# EAGLE schematic CAMERA_SHIELD (EAGLE 9.5.2)

## Sheet 1 of 2
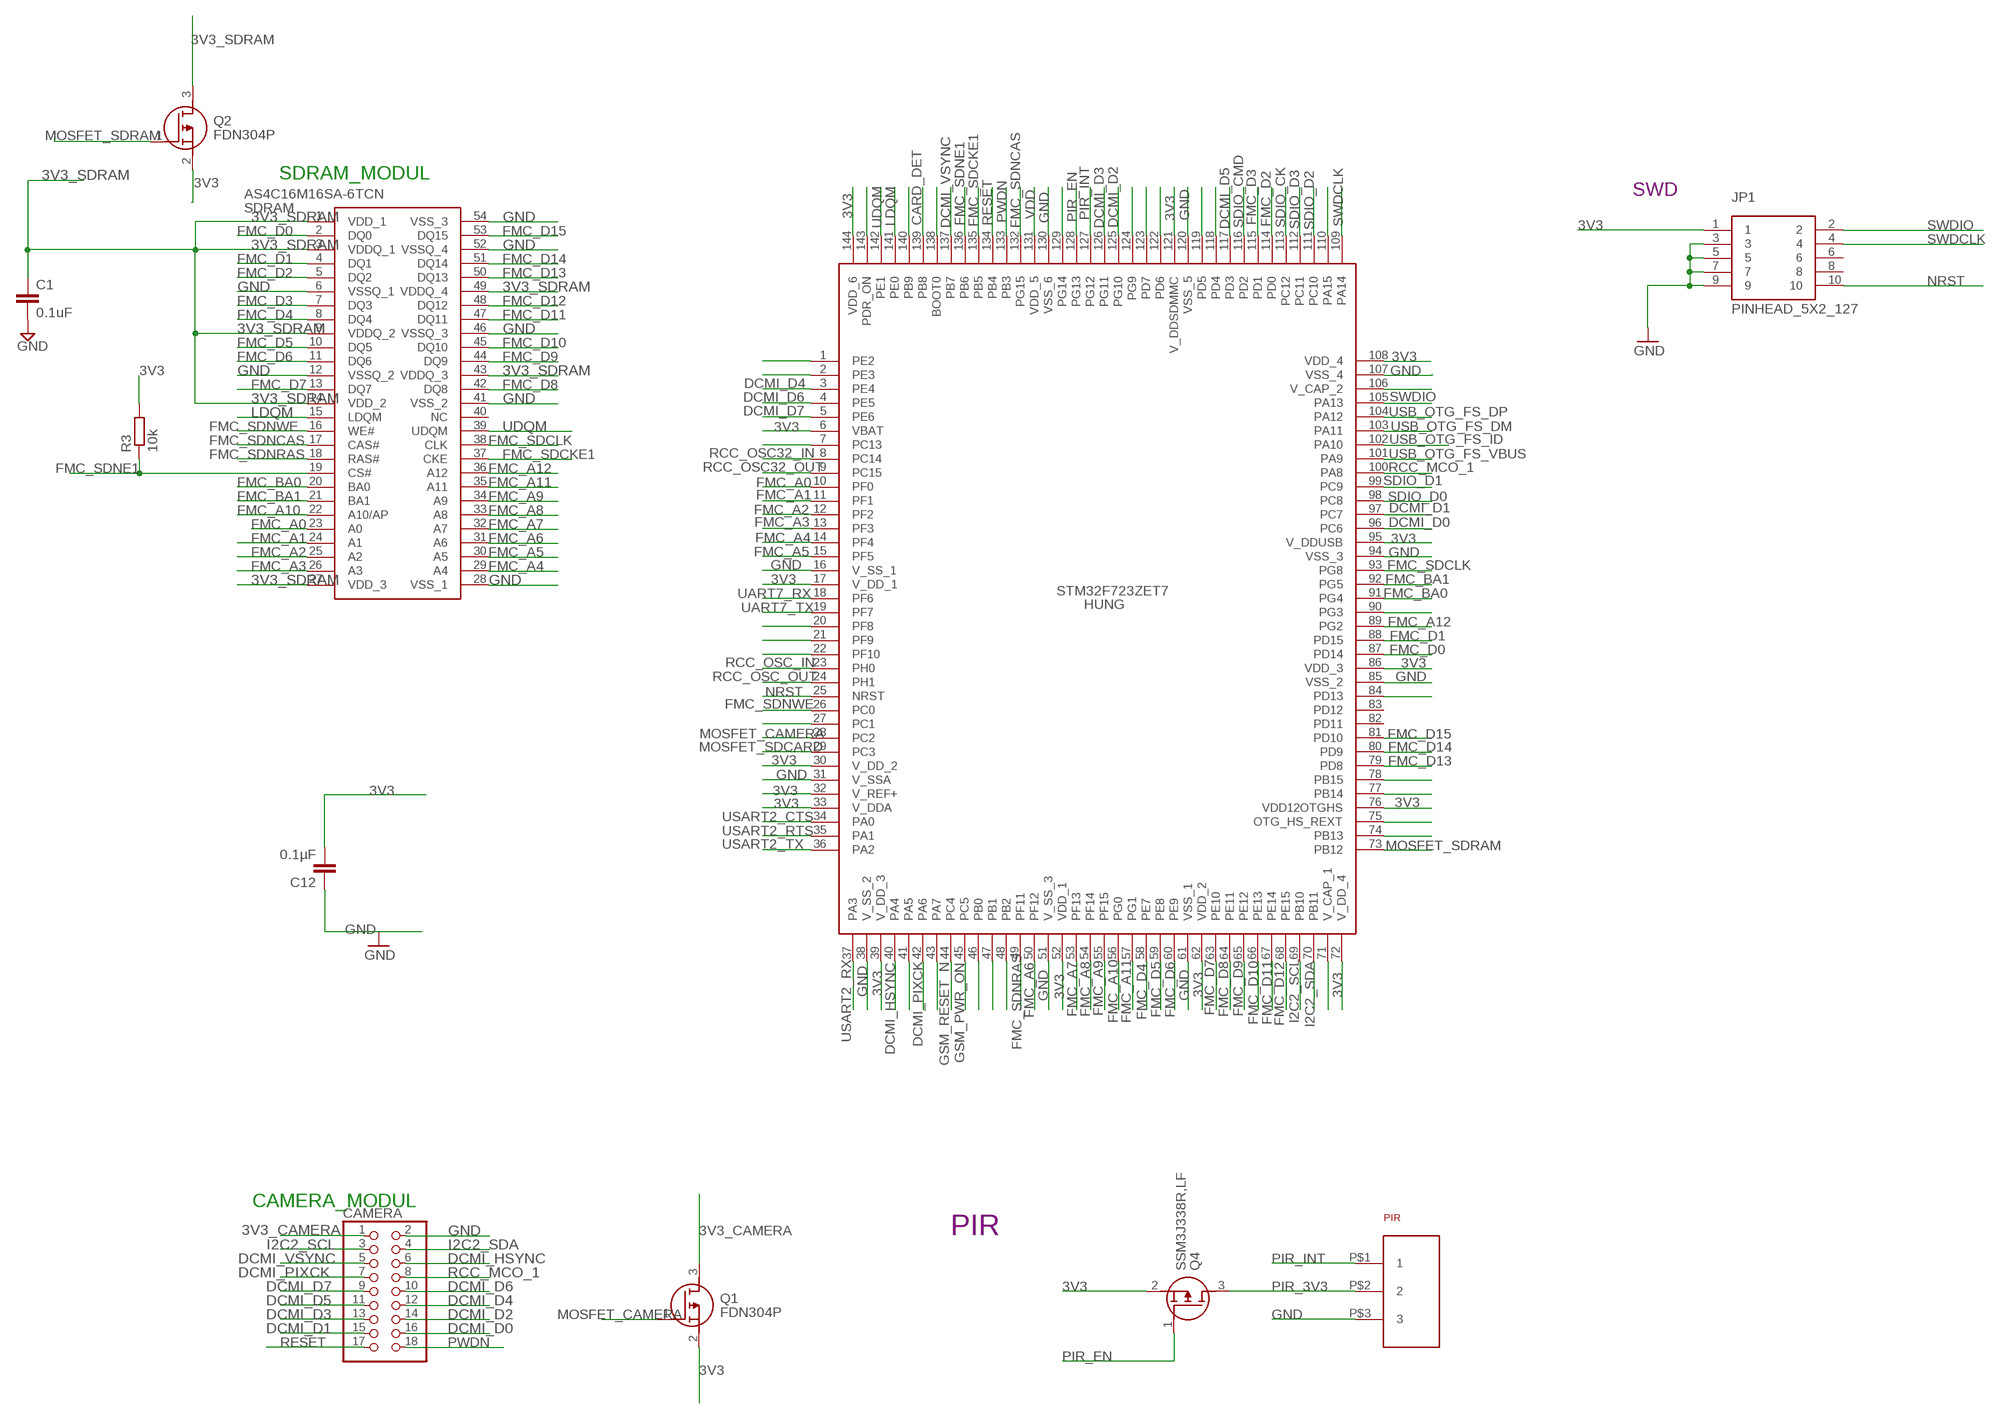
[diagram p0: schematic, sheet 1]

### Parts
C1  0.1uF  C-EUC0402K  [C0402K]
C12  0.1µF  C-EUC0402K  [C0402K]
CAMERA  0  PINHD-2X9  [2X09]
HUNG  STM32F723ZET7  [QFP50P2200X2200X160-144N]
JP1  PINHEAD_5X2_127  [PINHEAD_2X5_127]
PIR  SENBA_PIR_3PIN  [SENBA_PIR]
Q1  FDN304P  [SOT95P237X112-3N]
Q2  FDN304P  [SOT95P237X112-3N]
Q4  SSM3J338R,LF  [SSM3J332RLFT]
R3  10k  R_0402WEB_0402  [C0402K]
SDRAM  AS4C16M16SA-6TCN  [SOP80P1176X120-54N]

### Nets
3V3: C12.2 HUNG.6(VBAT) HUNG.17(V_DD_1) HUNG.30(V_DD_2) HUNG.32(V_REF+) HUNG.33(V_DDA) HUNG.39(V_DD_3) HUNG.52(VDD_1) HUNG.62(VDD_2) HUNG.72(V_DD_4) HUNG.76(VDD12OTGHS) HUNG.86(VDD_3) HUNG.95(V_DDUSB) HUNG.108(VDD_4) HUNG.121(V_DDSDMMC) HUNG.144(VDD_6) JP1.1 Q1.2(S) Q2.2(S) Q4.2(S) R3.2 ; also sheet 2
3V3_CAMERA: CAMERA.1 Q1.3(D)
3V3_SDRAM: C1.1 Q2.3(D) SDRAM.1(VDD_1) SDRAM.3(VDDQ_1) SDRAM.9(VDDQ_2) SDRAM.14(VDD_2) SDRAM.27(VDD_3) SDRAM.43(VDDQ_3) SDRAM.49(VDDQ_4)
CARD_DET: HUNG.139(PB8) ; also sheet 2
DCMI_D0: CAMERA.16 HUNG.96(PC6)
DCMI_D1: CAMERA.15 HUNG.97(PC7)
DCMI_D2: CAMERA.14 HUNG.125(PG10)
DCMI_D3: CAMERA.13 HUNG.126(PG11)
DCMI_D4: CAMERA.12 HUNG.3(PE4)
DCMI_D5: CAMERA.11 HUNG.117(PD3)
DCMI_D6: CAMERA.10 HUNG.4(PE5)
DCMI_D7: CAMERA.9 HUNG.5(PE6)
DCMI_HSYNC: CAMERA.6 HUNG.40(PA4)
DCMI_PIXCK: CAMERA.7 HUNG.42(PA6)
DCMI_VSYNC: CAMERA.5 HUNG.137(PB7)
FMC_A0: HUNG.10(PF0) SDRAM.23(A0)
FMC_A1: HUNG.11(PF1) SDRAM.24(A1)
FMC_A2: HUNG.12(PF2) SDRAM.25(A2)
FMC_A3: HUNG.13(PF3) SDRAM.26(A3)
FMC_A4: HUNG.14(PF4) SDRAM.29(A4)
FMC_A5: HUNG.15(PF5) SDRAM.30(A5)
FMC_A6: HUNG.50(PF12) SDRAM.31(A6)
FMC_A7: HUNG.53(PF13) SDRAM.32(A7)
FMC_A8: HUNG.54(PF14) SDRAM.33(A8)
FMC_A9: HUNG.55(PF15) SDRAM.34(A9)
FMC_A10: HUNG.56(PG0) SDRAM.22(A10/AP)
FMC_A11: HUNG.57(PG1) SDRAM.35(A11)
FMC_A12: HUNG.89(PG2) SDRAM.36(A12)
FMC_BA0: HUNG.91(PG4) SDRAM.20(BA0)
FMC_BA1: HUNG.92(PG5) SDRAM.21(BA1)
FMC_D0: HUNG.87(PD14) SDRAM.2(DQ0)
FMC_D1: HUNG.88(PD15) SDRAM.4(DQ1)
FMC_D2: HUNG.114(PD0) SDRAM.5(DQ2)
FMC_D3: HUNG.115(PD1) SDRAM.7(DQ3)
FMC_D4: HUNG.58(PE7) SDRAM.8(DQ4)
FMC_D5: HUNG.59(PE8) SDRAM.10(DQ5)
FMC_D6: HUNG.60(PE9) SDRAM.11(DQ6)
FMC_D7: HUNG.63(PE10) SDRAM.13(DQ7)
FMC_D8: HUNG.64(PE11) SDRAM.42(DQ8)
FMC_D9: HUNG.65(PE12) SDRAM.44(DQ9)
FMC_D10: HUNG.66(PE13) SDRAM.45(DQ10)
FMC_D11: HUNG.67(PE14) SDRAM.47(DQ11)
FMC_D12: HUNG.68(PE15) SDRAM.48(DQ12)
FMC_D13: HUNG.79(PD8) SDRAM.50(DQ13)
FMC_D14: HUNG.80(PD9) SDRAM.51(DQ14)
FMC_D15: HUNG.81(PD10) SDRAM.53(DQ15)
FMC_SDCKE1: HUNG.135(PB5) SDRAM.37(CKE)
FMC_SDCLK: HUNG.93(PG8) SDRAM.38(CLK)
FMC_SDNCAS: HUNG.132(PG15) SDRAM.17(CAS#)
FMC_SDNE1: HUNG.136(PB6) R3.1 SDRAM.19(CS#)
FMC_SDNRAS: HUNG.49(PF11) SDRAM.18(RAS#)
FMC_SDNWE: HUNG.26(PC0) SDRAM.16(WE#)
GND: C1.2 C12.1 CAMERA.2 HUNG.16(V_SS_1) HUNG.31(V_SSA) HUNG.38(V_SS_2) HUNG.51(V_SS_3) HUNG.61(VSS_1) HUNG.85(VSS_2) HUNG.94(VSS_3) HUNG.107(VSS_4) HUNG.120(VSS_5) HUNG.130(VSS_6) JP1.3 JP1.5 JP1.7 JP1.9 PIR.P$3 SDRAM.6(VSSQ_1) SDRAM.12(VSSQ_2) SDRAM.28(VSS_1) SDRAM.41(VSS_2) SDRAM.46(VSSQ_3) SDRAM.52(VSSQ_4) SDRAM.54(VSS_3) ; also sheet 2
GSM_PWR_ON: HUNG.45(PC5) ; also sheet 2
GSM_RESET_N: HUNG.44(PC4) ; also sheet 2
I2C2_SCL: CAMERA.3 HUNG.69(PB10) ; also sheet 2
I2C2_SDA: CAMERA.4 HUNG.70(PB11) ; also sheet 2
LDQM: HUNG.141(PE0) SDRAM.15(LDQM)
MOSFET_CAMERA: HUNG.28(PC2) Q1.1(G)
MOSFET_SDCARD: HUNG.29(PC3) ; also sheet 2
MOSFET_SDRAM: HUNG.73(PB12) Q2.1(G)
N$1: HUNG.1(PE2)
N$2: HUNG.2(PE3)
N$7: HUNG.7(PC13)
N$20: HUNG.20(PF8)
N$21: HUNG.21(PF9)
N$22: HUNG.22(PF10)
N$27: HUNG.27(PC1)
N$41: HUNG.41(PA5)
N$43: HUNG.43(PA7)
N$46: HUNG.46(PB0)
N$47: HUNG.47(PB1)
N$48: HUNG.48(PB2)
N$71: HUNG.71(V_CAP_1)
N$75: HUNG.106(V_CAP_2)
N$91: HUNG.90(PG3)
N$97: HUNG.84(PD13)
N$103: HUNG.78(PB15)
N$104: HUNG.77(PB14)
N$106: HUNG.75(OTG_HS_REXT)
N$107: HUNG.74(PB13)
N$110: HUNG.143(PDR_ON)
N$113: HUNG.140(PB9)
N$115: HUNG.138(BOOT0)
N$124: HUNG.129(PG14)
N$129: HUNG.124(PG9)
N$130: HUNG.123(PD7)
N$131: HUNG.122(PD6)
N$134: HUNG.119(PD5)
N$135: HUNG.118(PD4)
N$143: HUNG.110(PA15)
NRST: HUNG.25(NRST) JP1.10
PIR_3V3: PIR.P$2 Q4.3(D)
PIR_EN: HUNG.128(PG13) Q4.1(G)
PIR_INT: HUNG.127(PG12) PIR.P$1
PWDN: CAMERA.18 HUNG.133(PB3)
RCC_MCO_1: CAMERA.8 HUNG.100(PA8)
RCC_OSC32_IN: HUNG.8(PC14) ; also sheet 2
RCC_OSC32_OUT: HUNG.9(PC15) ; also sheet 2
RCC_OSC_IN: HUNG.23(PH0) ; also sheet 2
RCC_OSC_OUT: HUNG.24(PH1) ; also sheet 2
RESET: CAMERA.17 HUNG.134(PB4)
SDIO_CK: HUNG.113(PC12) ; also sheet 2
SDIO_CMD: HUNG.116(PD2) ; also sheet 2
SDIO_D0: HUNG.98(PC8) ; also sheet 2
SDIO_D1: HUNG.99(PC9) ; also sheet 2
SDIO_D2: HUNG.111(PC10) ; also sheet 2
SDIO_D3: HUNG.112(PC11) ; also sheet 2
SWDCLK: HUNG.109(PA14) JP1.4
SWDIO: HUNG.105(PA13) JP1.2
UART7_RX: HUNG.18(PF6) ; also sheet 2
UART7_TX: HUNG.19(PF7) ; also sheet 2
UDQM: HUNG.142(PE1) SDRAM.39(UDQM)
USART2_CTS: HUNG.34(PA0) ; also sheet 2
USART2_RTS: HUNG.35(PA1) ; also sheet 2
USART2_RX: HUNG.37(PA3) ; also sheet 2
USART2_TX: HUNG.36(PA2) ; also sheet 2
USB_OTG_FS_DM: HUNG.103(PA11) ; also sheet 2
USB_OTG_FS_DP: HUNG.104(PA12) ; also sheet 2
USB_OTG_FS_ID: HUNG.102(PA10) ; also sheet 2
USB_OTG_FS_VBUS: HUNG.101(PA9) ; also sheet 2
VDD: HUNG.131(VDD_5)
Unconnected: HUNG.82(PD11) HUNG.83(PD12) JP1.6 JP1.8 SDRAM.40(NC)

### Notes on the sheet
- SDRAM_MODUL
- SWD
- CAMERA_MODUL
- PIR

## Sheet 2 of 2
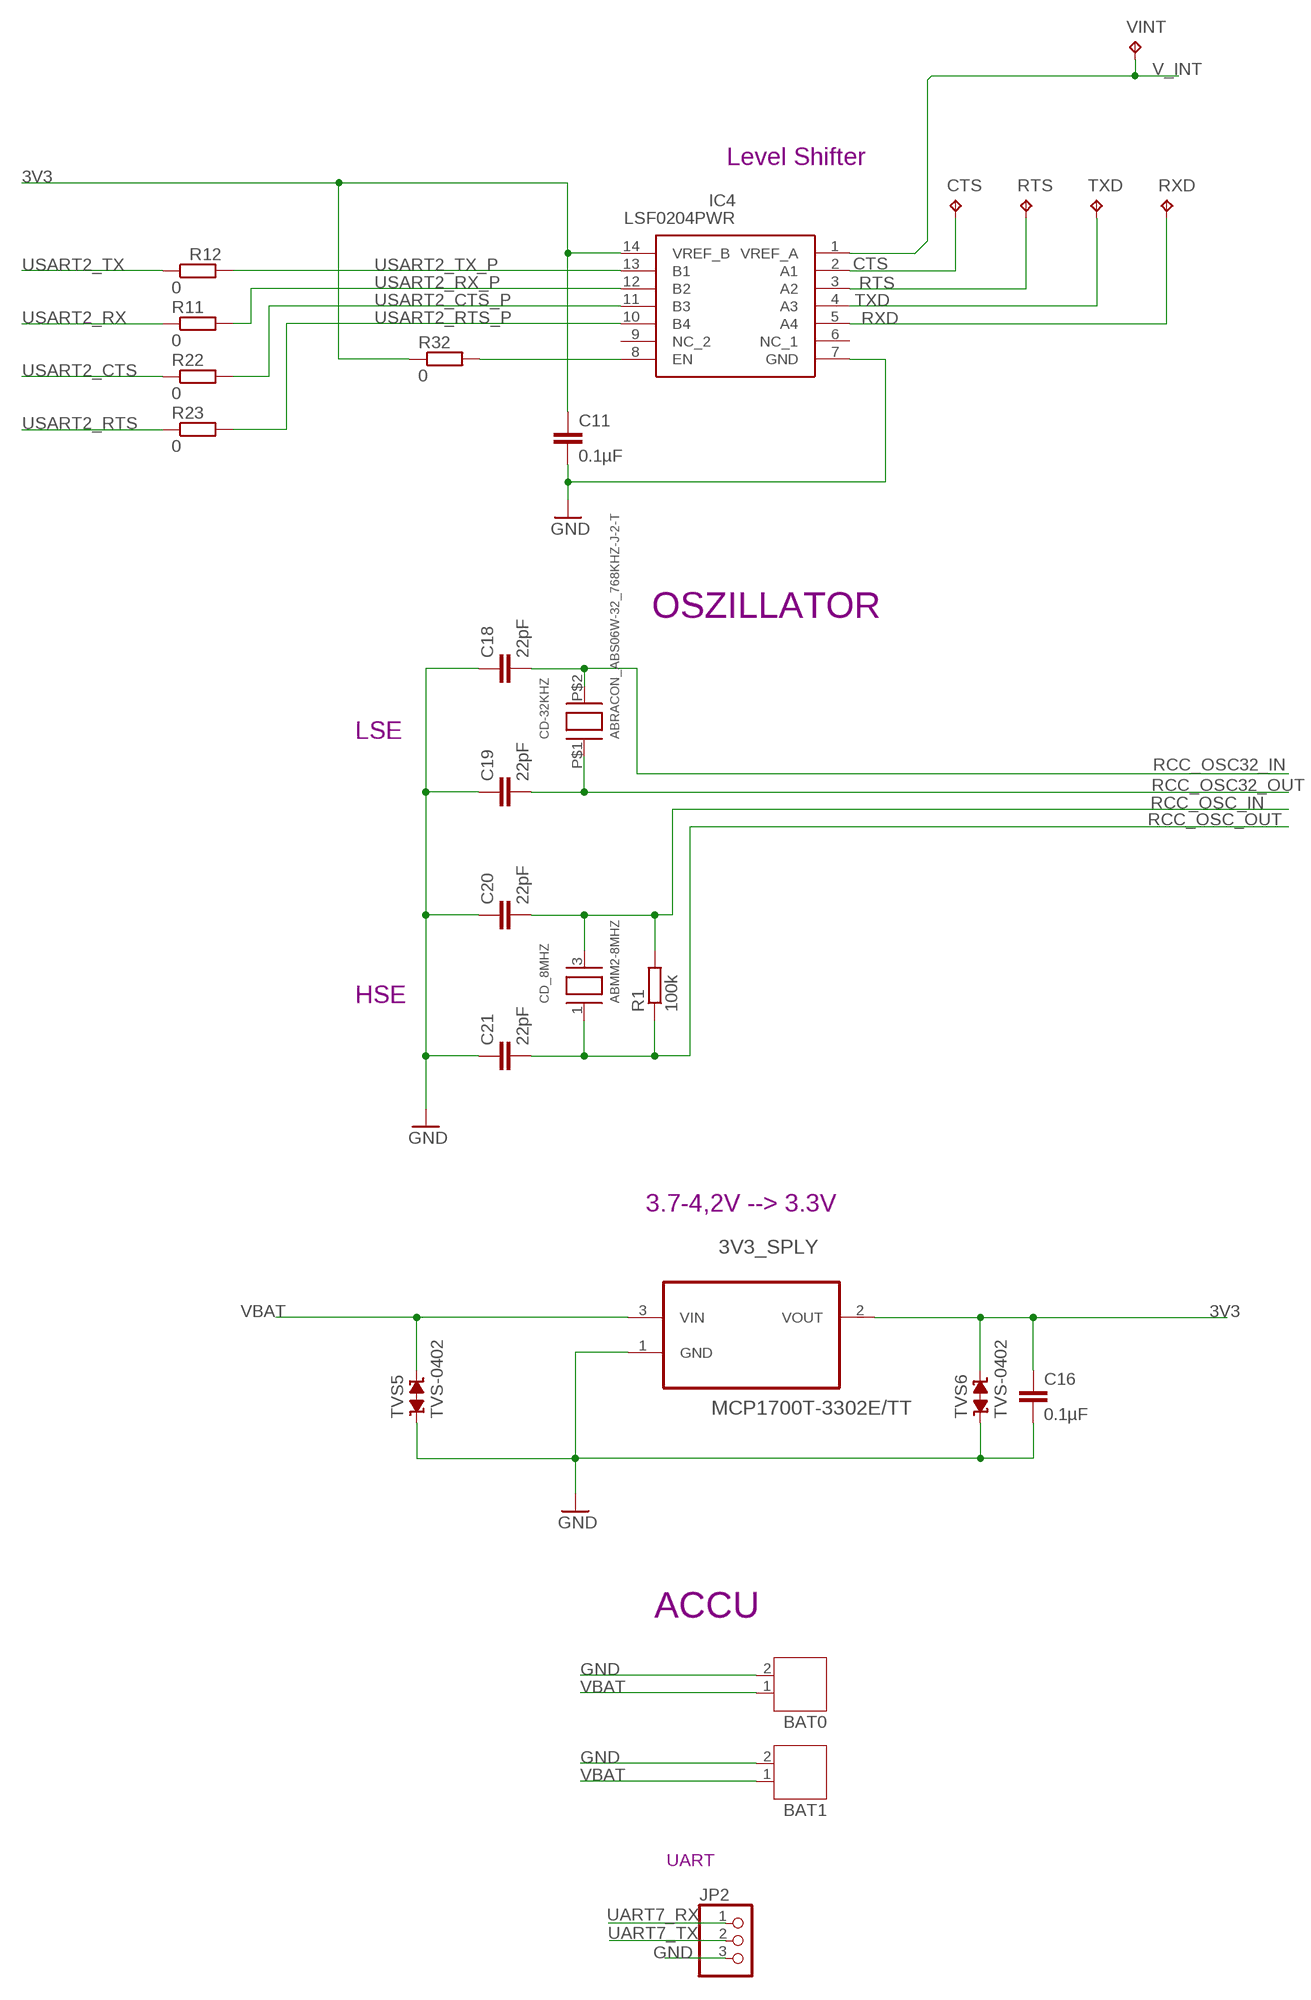
[diagram p1: schematic, sheet 2, part 1 of 2]
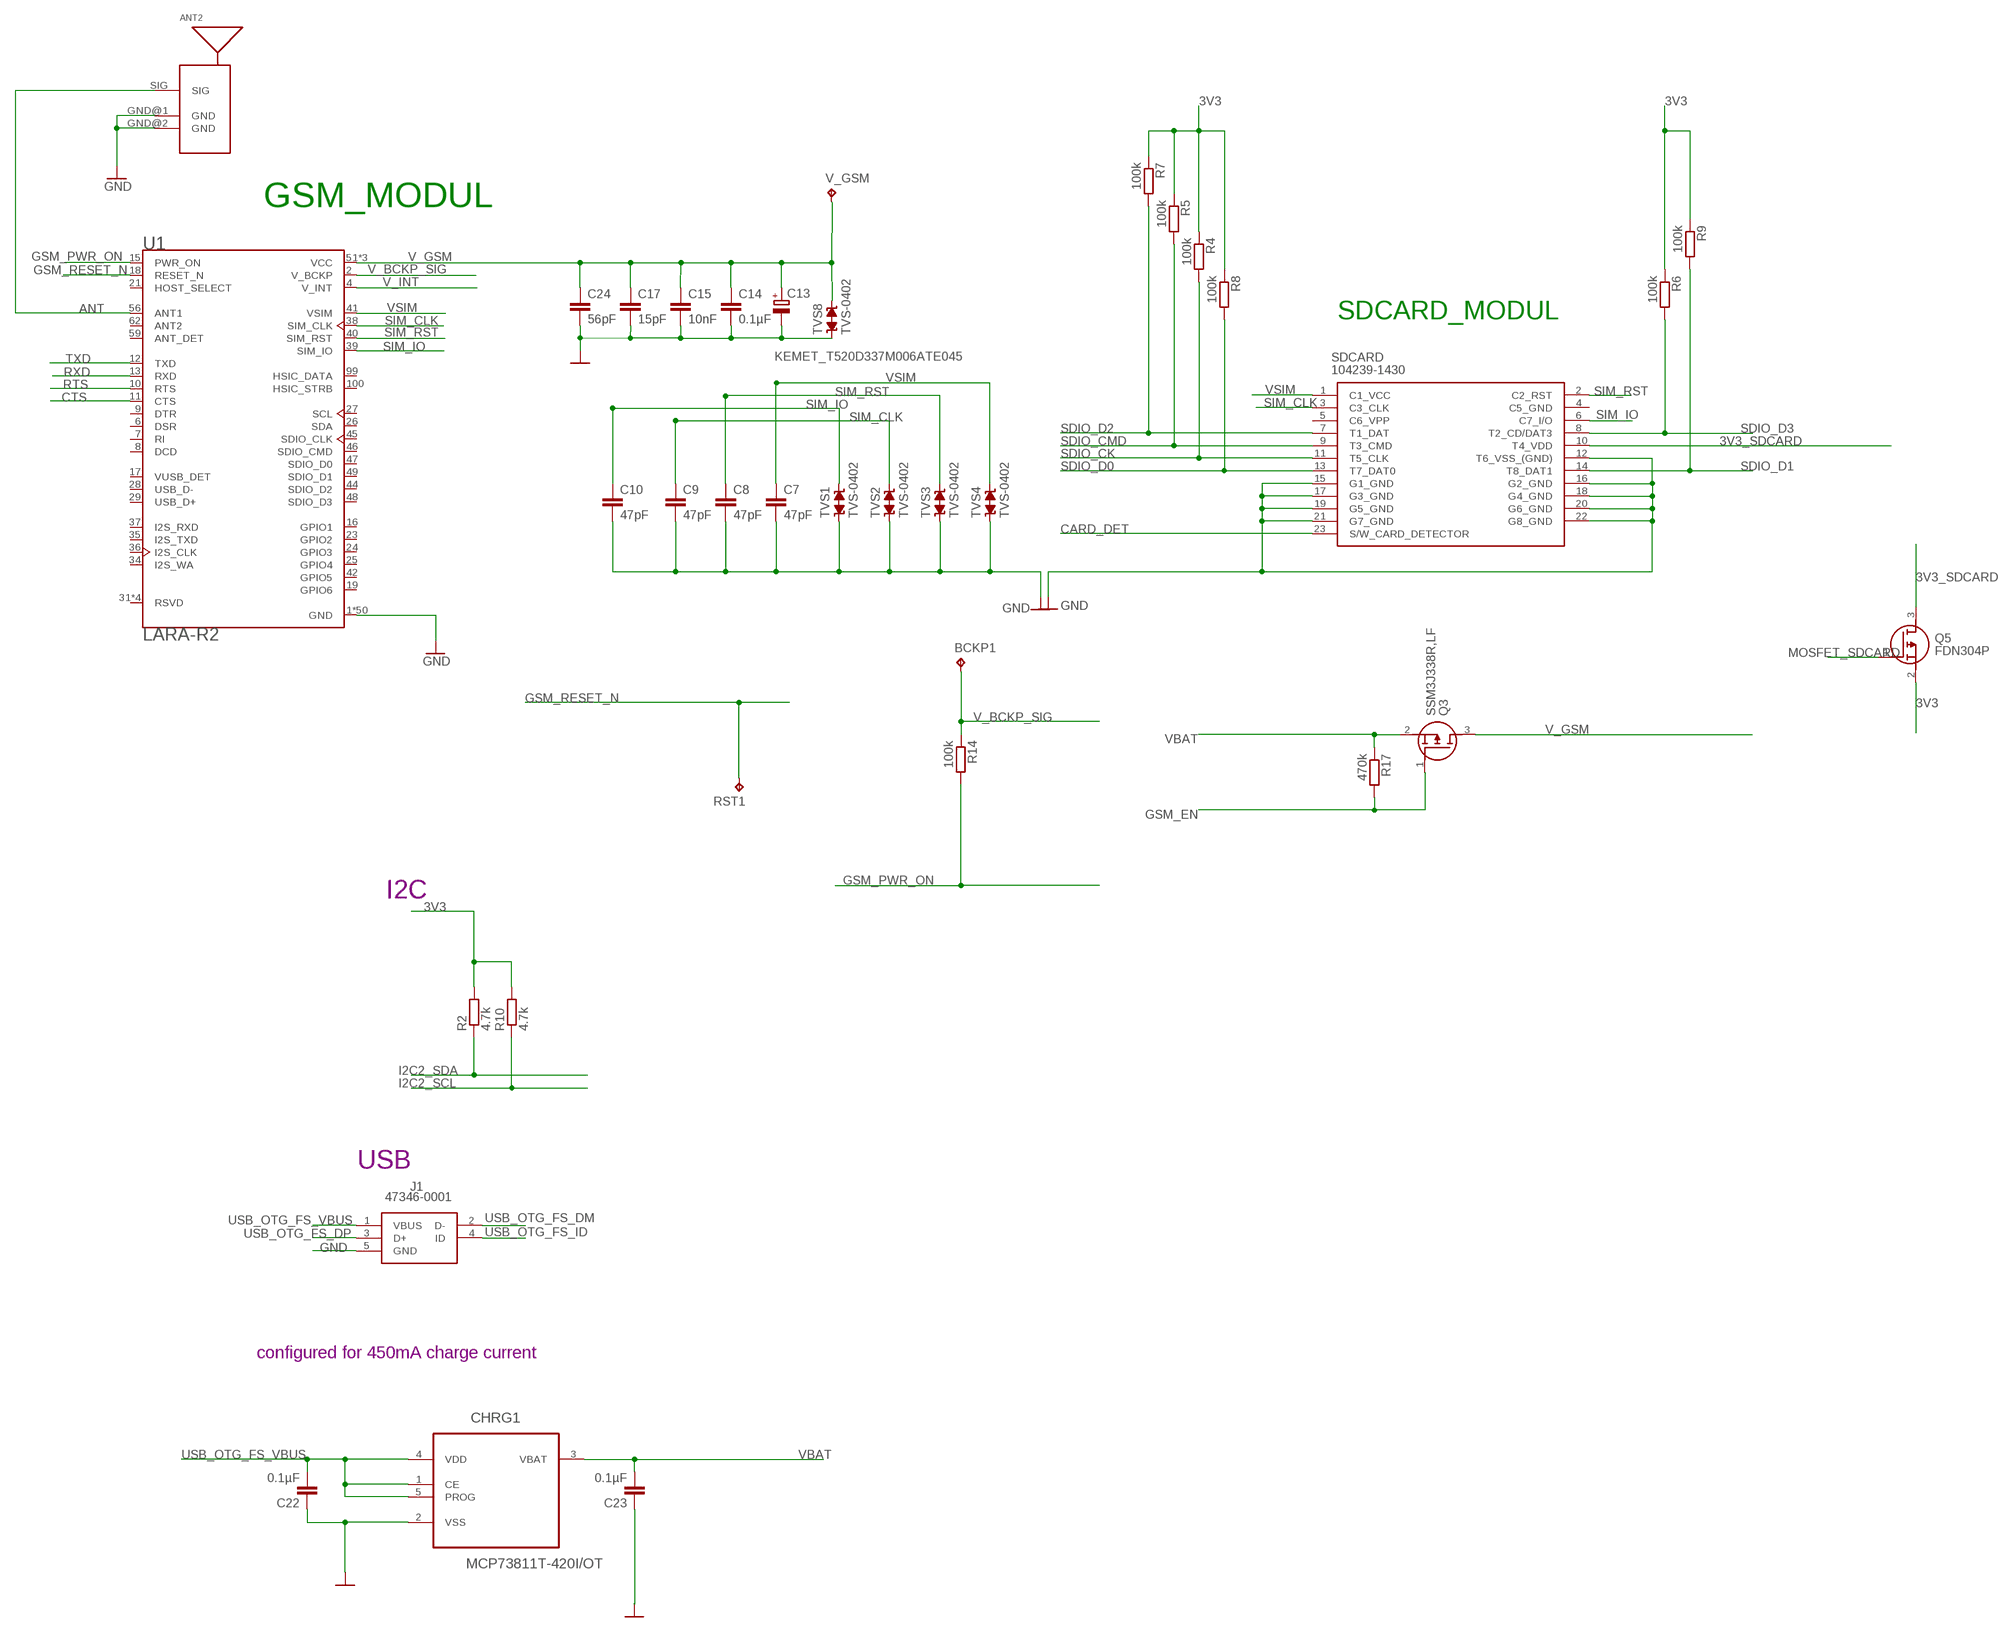
[diagram p2: schematic, sheet 2, part 2 of 2]

### Parts
3V3_SPLY  MCP1700T-3302E/TT  [SOT23]
ANT2  U.FL-R-SMT-1  [UFL_HIROSE]
BAT0  JST-PH2  [JST-PH2]
BAT1  JST-PH2  [JST-PH2]
BCKP1  TPB1,27  [B1,27]
C7  47pF  C-EUC0402K  [C0402K]
C8  47pF  C-EUC0402K  [C0402K]
C9  47pF  C-EUC0402K  [C0402K]
C10  47pF  C-EUC0402K  [C0402K]
C11  0.1µF  C-EUC0402K  [C0402K]
C13  KEMET_T520D337M006ATE045  [7343_METRIC]
C14  0.1µF  C-EUC0402K  [C0402K]
C15  10nF  C-EUC0402K  [C0402K]
C16  0.1µF  C-EUC0402K  [C0402K]
C17  15pF  C-EUC0402K  [C0402K]
C18  22pF  C-EUC0402K  [C0402K]
C19  22pF  C-EUC0402K  [C0402K]
C20  22pF  C-EUC0402K  [C0402K]
C21  22pF  C-EUC0402K  [C0402K]
C22  0.1µF  C-EUC0402K  [C0402K]
C23  0.1µF  C-EUC0402K  [C0402K]
C24  56pF  C-EUC0402K  [C0402K]
CD-32KHZ  ABRACON_ABS06W-32_768KHZ-J-2-T  [2MM_X_1_2MM]
CD_8MHZ  ABMM2-8MHZ  [CRYSTAL_ABRACON_6MM_3.6MM]
CHRG1  MCP73811T-420I/OT  [SOT23-5]
CTS  TPB1,27  [B1,27]
IC4  LSF0204PWR  [SOP65P640X120-14N]
J1  47346-0001  [47346-0001]
JP2  PINHD-1X3  [1X03]
Q3  SSM3J338R,LF  [SSM3J332RLFT]
Q5  FDN304P  [SOT95P237X112-3N]
R1  100k  R_0402WEB_0402  [C0402K]
R2  4.7k  R_0402WEB_0402  [C0402K]
R4  100k  R-EU_R0402  [R0402]
R5  100k  R-EU_R0402  [R0402]
R6  100k  R-EU_R0402  [R0402]
R7  100k  R-EU_R0402  [R0402]
R8  100k  R-EU_R0402  [R0402]
R9  100k  R-EU_R0402  [R0402]
R10  4.7k  R_0402WEB_0402  [C0402K]
R11  0  R-EU_R0402  [R0402]
R12  0  R-EU_R0402  [R0402]
R14  100k  R-EU_R0402  [R0402]
R17  470k  R-EU_R0402  [R0402]
R22  0  R-EU_R0402  [R0402]
R23  0  R-EU_R0402  [R0402]
R32  0  R_0402WEB_0402  [C0402K]
RST1  TPB1,27  [B1,27]
RTS  TPB1,27  [B1,27]
RXD  TPB1,27  [B1,27]
SDCARD  104239-1430  [1042391430]
TVS1  TVS-0402  [TVS0402]
TVS2  TVS-0402  [TVS0402]
TVS3  TVS-0402  [TVS0402]
TVS4  TVS-0402  [TVS0402]
TVS5  TVS-0402  [TVS0402]
TVS6  TVS-0402  [TVS0402]
TVS8  TVS-0402  [TVS0402]
TXD  TPB1,27  [B1,27]
U1  LARA-R2  [XCVR_LARA-R2]
V_GSM  TPB1,27  [B1,27]
VINT  TPB1,27  [B1,27]

### Nets
3V3: 3V3_SPLY.2(VOUT) C11.1 C16.1 IC4.14(VREF_B) Q5.2(S) R2.2 R4.1 R5.1 R6.1 R7.1 R8.1 R9.1 R10.2 R32.1 TVS6.2 ; also sheet 1
3V3_SDCARD: Q5.3(D) SDCARD.10(T4_VDD)
ANT: ANT2.SIG U1.56(ANT1)
CARD_DET: SDCARD.23(S/W_CARD_DETECTOR) ; also sheet 1
CTS: CTS.TP IC4.2(A1) U1.11(CTS)
GND: 3V3_SPLY.1(GND) ANT2.GND@1(GND) ANT2.GND@2(GND) BAT0.2 BAT1.2 C7.2 C8.2 C9.2 C10.2 C11.2 C13.- C14.2 C15.2 C16.2 C17.2 C18.1 C19.1 C20.1 C21.1 C22.1 C23.1 C24.2 CHRG1.2(VSS) IC4.7(GND) J1.5(GND) JP2.3 SDCARD.12(T6_VSS_(GND)) SDCARD.15(G1_GND) SDCARD.16(G2_GND) SDCARD.17(G3_GND) SDCARD.18(G4_GND) SDCARD.19(G5_GND) SDCARD.20(G6_GND) SDCARD.21(G7_GND) SDCARD.22(G8_GND) TVS1.1 TVS2.1 TVS3.1 TVS4.1 TVS5.1 TVS6.1 TVS8.1 U1.1(GND) U1.3(GND) U1.5(GND) U1.14(GND) U1.20(GND) U1.22(GND) U1.30(GND) U1.32(GND) U1.43(GND) U1.50(GND) U1.54(GND) U1.55(GND) U1.57(GND) U1.58(GND) U1.60(GND) U1.61(GND) U1.63(GND) U1.64(GND) U1.65(GND) U1.66(GND) U1.67(GND) U1.68(GND) U1.69(GND) U1.70(GND) U1.71(GND) U1.72(GND) U1.73(GND) U1.74(GND) U1.75(GND) U1.76(GND) U1.77(GND) U1.78(GND) U1.79(GND) U1.80(GND) U1.81(GND) U1.82(GND) U1.83(GND) U1.84(GND) U1.85(GND) U1.86(GND) U1.87(GND) U1.88(GND) U1.89(GND) U1.90(GND) U1.91(GND) U1.92(GND) U1.93(GND) U1.94(GND) U1.95(GND) U1.96(GND) ; also sheet 1
GSM_EN: Q3.1(G) R17.2
GSM_PWR_ON: R14.2 U1.15(PWR_ON) ; also sheet 1
GSM_RESET_N: RST1.TP U1.18(RESET_N) ; also sheet 1
I2C2_SCL: R10.1 ; also sheet 1
I2C2_SDA: R2.1 ; also sheet 1
MOSFET_SDCARD: Q5.1(G) ; also sheet 1
N$12: IC4.8(EN) R32.2
RCC_OSC32_IN: C18.2 CD-32KHZ.P$2(C1) ; also sheet 1
RCC_OSC32_OUT: C19.2 CD-32KHZ.P$1(C0) ; also sheet 1
RCC_OSC_IN: C20.2 CD_8MHZ.3(C1) R1.2 ; also sheet 1
RCC_OSC_OUT: C21.2 CD_8MHZ.1(C0) R1.1 ; also sheet 1
RTS: IC4.3(A2) RTS.TP U1.10(RTS)
RXD: IC4.5(A4) RXD.TP U1.13(RXD)
SDIO_CK: R4.2 SDCARD.11(T5_CLK) ; also sheet 1
SDIO_CMD: R5.2 SDCARD.9(T3_CMD) ; also sheet 1
SDIO_D0: R8.2 SDCARD.13(T7_DAT0) ; also sheet 1
SDIO_D1: R9.2 SDCARD.14(T8_DAT1) ; also sheet 1
SDIO_D2: R7.2 SDCARD.7(T1_DAT) ; also sheet 1
SDIO_D3: R6.2 SDCARD.8(T2_CD/DAT3) ; also sheet 1
SIM_CLK: C9.1 SDCARD.3(C3_CLK) TVS2.2 U1.38(SIM_CLK)
SIM_IO: C10.1 SDCARD.6(C7_I/O) TVS1.2 U1.39(SIM_IO)
SIM_RST: C8.1 SDCARD.2(C2_RST) TVS3.2 U1.40(SIM_RST)
TXD: IC4.4(A3) TXD.TP U1.12(TXD)
UART7_RX: JP2.1 ; also sheet 1
UART7_TX: JP2.2 ; also sheet 1
USART2_CTS: R22.1 ; also sheet 1
USART2_CTS_P: IC4.11(B3) R22.2
USART2_RTS: R23.1 ; also sheet 1
USART2_RTS_P: IC4.10(B4) R23.2
USART2_RX: R11.1 ; also sheet 1
USART2_RX_P: IC4.12(B2) R11.2
USART2_TX: R12.1 ; also sheet 1
USART2_TX_P: IC4.13(B1) R12.2
USB_OTG_FS_DM: J1.2(D-) ; also sheet 1
USB_OTG_FS_DP: J1.3(D+) ; also sheet 1
USB_OTG_FS_ID: J1.4(ID) ; also sheet 1
USB_OTG_FS_VBUS: C22.2 CHRG1.1(CE) CHRG1.4(VDD) CHRG1.5(PROG) J1.1(VBUS) ; also sheet 1
V_BCKP_SIG: BCKP1.TP R14.1 U1.2(V_BCKP)
V_GSM: C13.+ C14.1 C15.1 C17.1 C24.1 Q3.3(D) TVS8.2 U1.51(VCC) U1.52(VCC) U1.53(VCC) V_GSM.TP
V_INT: IC4.1(VREF_A) U1.4(V_INT) VINT.TP
VBAT: 3V3_SPLY.3(VIN) BAT0.1 BAT1.1 C23.2 CHRG1.3(VBAT) Q3.2(S) R17.1 TVS5.2
VSIM: C7.1 SDCARD.1(C1_VCC) TVS4.2 U1.41(VSIM)
Unconnected: IC4.6(NC_1) IC4.9(NC_2) SDCARD.4(C5_GND) SDCARD.5(C6_VPP) U1.6(DSR) U1.7(RI) U1.8(DCD) U1.9(DTR) U1.16(GPIO1) U1.17(VUSB_DET) U1.19(GPIO6) U1.21(HOST_SELECT) U1.23(GPIO2) U1.24(GPIO3) U1.25(GPIO4) U1.26(SDA) U1.27(SCL) U1.28(USB_D-) U1.29(USB_D+) U1.31(RSVD) U1.33(RSVD) U1.34(I2S_WA) U1.35(I2S_TXD) U1.36(I2S_CLK) U1.37(I2S_RXD) U1.42(GPIO5) U1.44(SDIO_D2) U1.45(SDIO_CLK) U1.46(SDIO_CMD) U1.47(SDIO_D0) U1.48(SDIO_D3) U1.49(SDIO_D1) U1.59(ANT_DET) U1.62(ANT2) U1.97(RSVD) U1.98(RSVD) U1.99(HSIC_DATA) U1.100(HSIC_STRB)

### Notes on the sheet
- Level Shifter
- GSM_MODUL
- SDCARD_MODUL
- OSZILLATOR
- LSE
- HSE
- 3.7-4,2V --> 3.3V | I2C
- USB
- ACCU
- configured for 450mA charge current
- UART

## Library data of the parts
3V3_SPLY = sicom_universal:MCP1700T-3302E/TT: Low Quiescent Current LDO Mouser <http://www.mouser.de/ProductDetail/Microchip-Technology/MCP1700T-3302E-TT/?qs=sGAEpiMZZMsGz1a6aV8DcOAsZlYjMPgHQ77X2jgUeNU%3d>; MPN: MCP1700T-3302E/TT; OC_FARNELL: 1296592; OC_NEWARK: 88H9817; PACKAGE: SOT23-3; SUPPLIER: Microchip
ANT2 = sicom_universal:U.FL-R-SMT-1
BAT0 BAT1 = sicom_universal:JST-PH2
BCKP1 CTS RST1 RTS RXD TXD V_GSM VINT = testpad:TP: Test pad
C1 C7-C12 C14-C24 = rcl:C-EU: CAPACITOR, European symbol; SPICEPREFIX: C
C13 = sicom_universal:KEMET_T520D337M006ATE045: T520D337M006ATE045
CAMERA = pinhead:PINHD-2X9: PIN HEADER
CD-32KHZ = sicom_universal:ABRACON_ABS06W-32_768KHZ-J-2-T
CD_8MHZ = sicom_universal:ABMM2-8MHZ; MPN: ABMM2-8.0000MHZ-E1-T
CHRG1 = sicom_universal:MCP73811T-420I/OT: MCP73811T-420I/OT Battery-Management Simple Integr Li-Ion/Li-Poly Chrg; MPN: MCP73811T-420I/OT; SUPPLIER: Microchip
HUNG = STM32F723ZET7:STM32F723ZET7: ARM Microcontrollers - MCU 16/32-BITS MICROS Source: Datasheet <https://componentsearchengine.com/Datasheets/1/STM32F723ZET7.pdf>; DESCRIPTION: ARM Microcontrollers - MCU 16/32-BITS MICROS; HEIGHT: 1.6mm; MANUFACTURER_NAME: STMicroelectronics; MANUFACTURER_PART_NUMBER: STM32F723ZET7; MOUSER_PART_NUMBER: 511-STM32F723ZET7; MOUSER_PRICE-STOCK: https://www.mouser.com/Search/Refine.aspx?Keyword=511-STM32F723ZET7
IC4 = SamacSys_Parts:LSF0204PWR: 4-Bit Bidirectional Multi-Voltage Level Translator for Open-Drain & Push- Pull Source: Datasheet <http://www.ti.com/lit/gpn/lsf0204>; DESCRIPTION: 4-Bit Bidirectional Multi-Voltage Level Translator for Open-Drain & Push- Pull; HEIGHT: 1.2mm; MANUFACTURER_NAME: Texas Instruments; MANUFACTURER_PART_NUMBER: LSF0204PWR; MOUSER_PART_NUMBER: 595-LSF0204PWR
J1 = usb_connector:47346-0001: Micro USB B Receptacle Bottom Mount Assy Molex Right Angle SMT Type B Version 2.0 Micro USB Connector Socket, 30 V ac, 1A 47352 MICRO-USB Source: Datasheet <http://www.molex.com/pdm_docs/sd/473460001_sd.pdf>; DESCRIPTION: Micro USB B Receptacle Bottom Mount Assy Molex Right Angle SMT Type B Version 2.0 Micro USB Connector Socket, 30 V ac, 1A 47352 MICRO-USB; HEIGHT: mm; MANUFACTURER_NAME: Molex; MANUFACTURER_PART_NUMBER: 47346-0001
JP1 = sicom_universal:PINHEAD_5X2_127: Pinheader 5 x 2 1,27mm pitch Mouser <http://www.mouser.de/ProductDetail/FCI/20021121-00010C4LF/?qs=%2fha2pyFaduhk6vEDe5a0MwjRWUz4Zk9Fskpe5qL0Xo%2fyZkFkIBBW%2flKXwnPu0N9C>; MPN: 3221-10-0100-00
JP2 = pinhead:PINHD-1X3: PIN HEADER
PIR = sicom_universal:SENBA_PIR_3PIN
Q1 Q2 Q5 = FDN304P:FDN304P: FDN304P P-Channel MOSFET, 2.4 A, 20 V PowerTrench, 3-Pin SOT-23 ON Semiconductor Source: Datasheet <https://componentsearchengine.com/Datasheets/1/FDN304P.pdf>; DESCRIPTION: FDN304P P-Channel MOSFET, 2.4 A, 20 V PowerTrench, 3-Pin SOT-23 ON Semiconductor; HEIGHT: 1.12mm; MANUFACTURER_NAME: ON Semiconductor; MANUFACTURER_PART_NUMBER: FDN304P; MOUSER_PART_NUMBER: 512-FDN304P; MOUSER_PRICE-STOCK: https://www.mouser.com/Search/Refine.aspx?Keyword=512-FDN304P
Q3 Q4 = SamacSys_Parts:SSM3J338R,LF: MOSFET Small-signal MOSFET Vdss= -12V, ID= -6A Source: Datasheet <https://componentsearchengine.com/Datasheets/1/SSM3J338R,LF.pdf>; DESCRIPTION: MOSFET Small-signal MOSFET Vdss= -12V, ID= -6A; HEIGHT: mm; MANUFACTURER_NAME: Toshiba; MANUFACTURER_PART_NUMBER: SSM3J338R,LF; MOUSER_PART_NUMBER: 757-SSM3J338RLF
R1-R3 R10 R32 = sicom_universal:R_0402
R4-R9 R11 R12 R14 R17 R22 R23 = rcl:R-EU_: RESISTOR, European symbol; SPICEPREFIX: R
SDCARD = SamacSys_Parts:104239-1430: Molex 104239 Series 6 (Nano SD), 8 (microSD) Way MicroSD, Nano SIM Memory Card Connector with Solder Termination Source: Datasheet <https://componentsearchengine.com/Datasheets/1/104239-1430.pdf>; DESCRIPTION: Molex 104239 Series 6 (Nano SD), 8 (microSD) Way MicroSD, Nano SIM Memory Card Connector with Solder Termination; HEIGHT: 2mm; MANUFACTURER_NAME: Molex; MANUFACTURER_PART_NUMBER: 104239-1430; MOUSER_PART_NUMBER: 538-104239-1430
SDRAM = sdram:AS4C16M16SA-6TCN: 256M (16Mx16bit) Synchronous DRAM (SDRAM) Source: Datasheet <https://componentsearchengine.com/Datasheets/1/AS4C16M16SA-6TCN.pdf>; DESCRIPTION: 256M (16Mx16bit) Synchronous DRAM (SDRAM); HEIGHT: 1.2mm; MANUFACTURER_NAME: Alliance Memory; MANUFACTURER_PART_NUMBER: AS4C16M16SA-6TCN; MOUSER_PART_NUMBER: 913-4C16M16SA-6TCN; MOUSER_PRICE-STOCK: https://www.mouser.com/Search/Refine.aspx?Keyword=913-4C16M16SA-6TCN
TVS1-TVS6 TVS8 = supressor:TVS-: TVS BI-DIRECTIONAL; MPN: GG0402050R3C2P
U1 = LARA-R2:LARA-R2: LARA-R2 series: Size-optimized LTE Cat 1 modules in single and multi-mode configurations; AVAILABILITY: Unavailable; DESCRIPTION: Cellular 4G LTE CAT-1 _Verizon_ Transceiver Module 900MHz, 1.8GHz Antenna Not Included, Castellation Surface Mount; MF: U-Blox America; MP: LARA-R2; PACKAGE: SMD-100 U-Blox America; PRICE: None